# EAGLE design schematic_fitband2 (EAGLE 9.6.2)
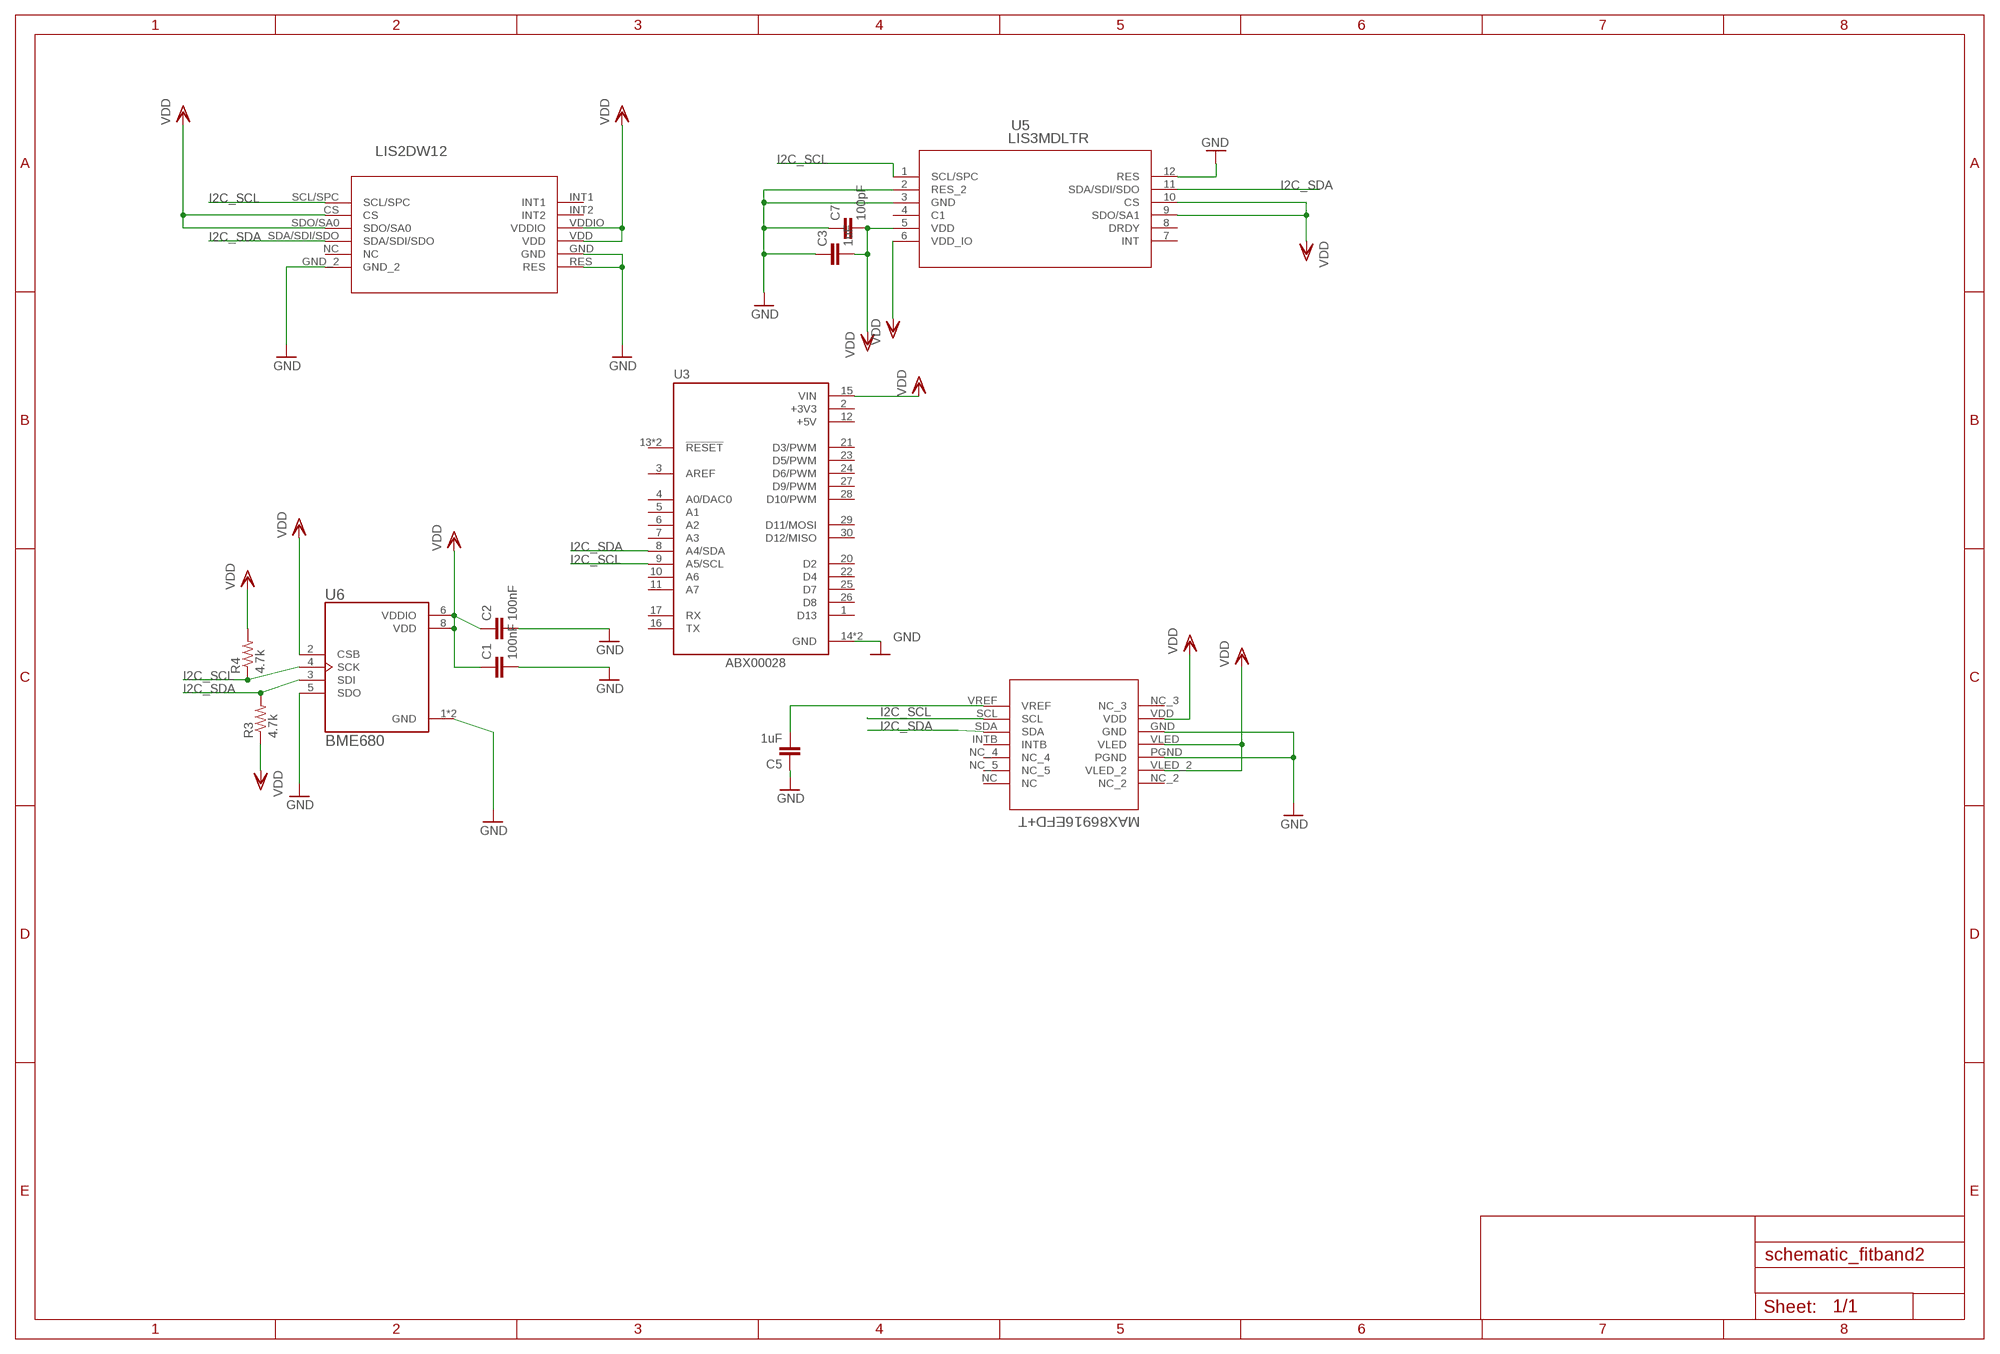
[diagram p0: schematic, sheet 1]

## Parts
C1  100nF  221E_PASSIVES_C0402  [221E_PASSIVES_C0402]
C2  100nF  221E_PASSIVES_C0402  [221E_PASSIVES_C0402]
C3  1uF  221E_PASSIVES_C0402  [221E_PASSIVES_C0402]
C5  1uF  221E_PASSIVES_C0402  [221E_PASSIVES_C0402]
C7  100pF  221E_PASSIVES_C0402  [221E_PASSIVES_C0402]
R3  4.7k  R-US_M0805  [M0805]
R4  4.7k  R-US_M0805  [M0805]
U1  MAX86916EFD+T  [21-100325_90-100122]
U2  LIS2DW12  [LIS2DW12_LGA-12_2X2X0P7_STM]
U3  ABX00028  [MODULE_ABX00028]
U5  LIS3MDLTR  [LGA-12_2X2X1_STM]
U6  BME680  [PSON80P300X300X100-8N]

## Nets
GND: C1.P$2 C2.P$2 C3.P$1 C5.P$1 C7.P$1 U1.GND U1.PGND U2.GND U2.GND_2 U2.RES U3.14(GND) U3.19(GND) U5.2(RES_2) U5.3(GND) U5.12(RES) U6.1(GND) U6.5(SDO) U6.7(GND)
I2C_SCL: R4.1 U1.SCL U2.SCL/SPC U3.9(A5/SCL) U5.1(SCL/SPC) U6.4(SCK)
I2C_SDA: R3.2 U1.SDA U2.SDA/SDI/SDO U3.8(A4/SDA) U5.11(SDA/SDI/SDO) U6.3(SDI)
N$1: C5.P$2 U1.VREF
VDD: C1.P$1 C2.P$1 C3.P$2 C7.P$2 R3.1 R4.2 U1.VDD U1.VLED U1.VLED_2 U2.CS U2.SDO/SA0 U2.VDD U2.VDDIO U3.15(VIN) U5.5(VDD) U5.6(VDD_IO) U5.9(SDO/SA1) U5.10(CS) U6.2(CSB) U6.6(VDDIO) U6.8(VDD)
Unconnected: U1.INTB U1.NC U1.NC_2 U1.NC_3 U1.NC_4 U1.NC_5 U2.INT1 U2.INT2 U2.NC U3.1(D13) U3.3(AREF) U3.4(A0/DAC0) U3.5(A1) U3.6(A2) U3.7(A3) U3.10(A6) U3.11(A7) U3.13(!RESET) U3.16(TX) U3.17(RX) U3.18(!RESET) U3.20(D2) U3.21(D3/PWM) U3.22(D4) U3.23(D5/PWM) U3.24(D6/PWM) U3.25(D7) U3.26(D8) U3.27(D9/PWM) U3.28(D10/PWM) U3.29(D11/MOSI) U3.30(D12/MISO) U5.4(C1) U5.7(INT) U5.8(DRDY)

## Power pins joined to a net without a drawn wire
+3V3: U3.2(+3V3)
+5V: U3.12(+5V)

## Library data of the parts
C1-C3 C5 C7 = PPG:221E_PASSIVES_C
R3 R4 = rcl:R-US_: RESISTOR, American symbol; SPICEPREFIX: R
U1 = max86916:MAX86916EFD+T: Max86916 eagle component, it's a ppg sensor with 4 different leds; BUILT_BY: EMA_Rebekah; COPYRIGHT: Copyright (C) 2018 Accelerated Designs. All rights reserved; MANUFACTURER_PART_NUMBER: MAX86916EFD+T; SOURCELIBRARY: Maxim_2020-05-05; VENDOR: Maxim Integrated Products
U2 = LIS2DW12:LIS2DW12
U3 = ABX00028:ABX00028: ATmega4809 Arduino Nano Every AVR AVR MCU 8-Bit Embedded Evaluation Board Check availability <https://pricing.snapeda.com/parts/Arduino%20Nano%20Every/Arduino/view-part?ref=eda>; AVAILABILITY: Not in stock; DESCRIPTION: Arduino’s 5V compatible board in the smallest available form factor: 45x18mm!; MF: Arduino; MP: Arduino Nano Every; PACKAGE: None; PRICE: None
U5 = LIS3MDLTR:LIS3MDLTR; COPYRIGHT: Copyright (C) 2023 Ultra Librarian. All rights reserved.; MANUFACTURER_PART_NUMBER: LIS3MDLTR; MFR_NAME: STMicroelectronics
U6 = BME680:BME680: Integrated Environmental Unit Check availability <https://pricing.snapeda.com/parts/BME680/Bosch%20Sensortec/view-part?ref=eda>; AVAILABILITY: In Stock; DESCRIPTION: Gas, Humidity, Pressure, Temperature Sensor I²C, SPI Output; MF: Bosch Sensortec; MP: BME680; PACKAGE: LGA-8 Bosch Tools; PRICE: None; PURCHASE-URL: https://pricing.snapeda.com/search/part/BME680/?ref=eda

## Net classes
1 VDD: width 0.254 mm

## Board
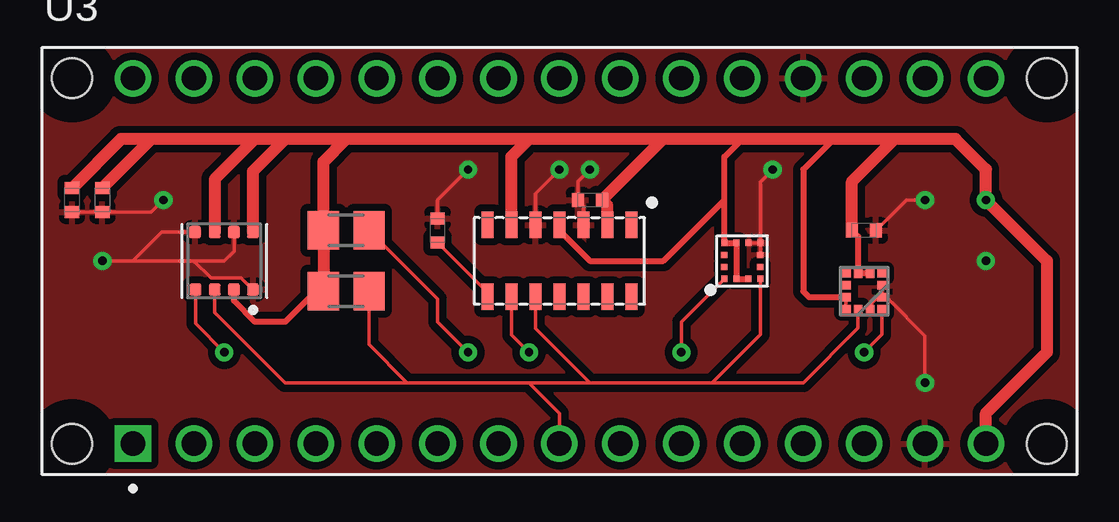
[diagram p1: board, top side]
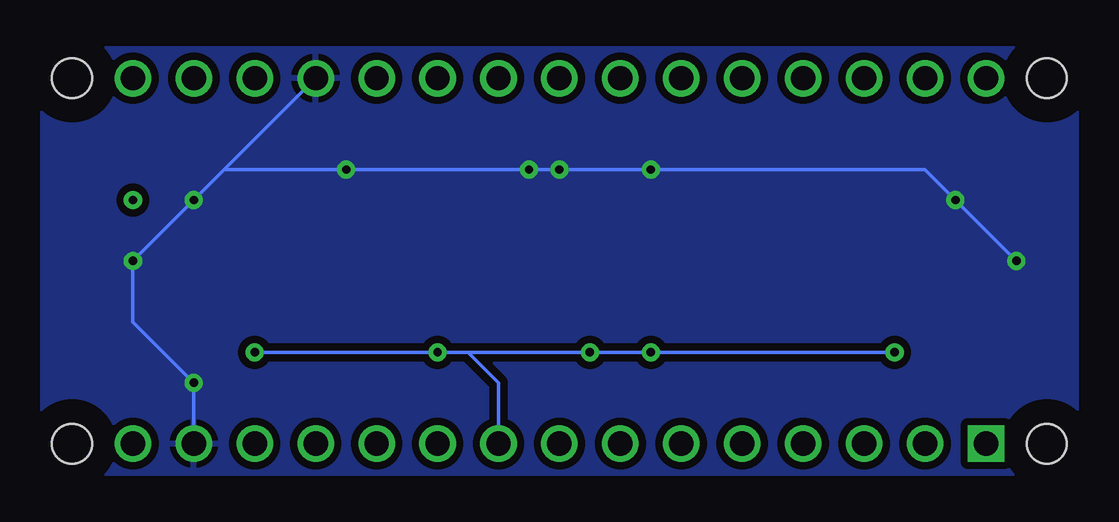
[diagram p2: board, bottom side, seen from below]

No outline drawn. Coordinates in mm, seen from the top.
Copper layers (1*16): Top 0.035mm / dielectric 1.5mm / Bottom 0.035mm
Design rules "default": minimum track width 6mil, minimum drill 0.35mm, track to track 6mil, track to pad 6mil, pad to pad 6mil, via to via 6mil, smd to smd 6mil, copper to edge 40mil, drill to drill 6mil, minimum pad ring 10mil, minimum via ring 8mil, stop-mask expansion 4mil, vias tented up to drill 0mil, thermal gap 10mil

### Footprints (pad centres in the part's own frame; a part is rotated, then mirrored left to right if it is on the bottom)
221E_PASSIVES_C0402 = smd 0.5 x 0.6: P$1 -0.5,0; P$2 0.5,0
M0805 = smd 1.3 x 1.6: 1 -0.95,0; 2 0.95,0
21-100325_90-100122 = smd 1.1 x 0.5: GND -1.5,-1; INTB 1.5,0; NC 1.5,3; NC_2 -1.5,3; NC_3 -1.5,-3; NC_4 1.5,1; NC_5 1.5,2; PGND -1.5,1; SCL 1.5,-2; SDA 1.5,-1; VDD -1.5,-2; VLED -1.5,0; VLED_2 -1.5,2; VREF 1.5,-3
LIS2DW12_LGA-12_2X2X0P7_STM = smd 0.275 x 0.25: CS -0.75,0.25; GND 0.75,-0.25; RES 0.75,-0.75; SCL/SPC -0.75,0.75; SDA/SDI/SDO -0.75,-0.75; SDO/SA0 -0.75,-0.25; VDD 0.75,0.25; VDDIO 0.75,0.75 | smd 0.25 x 0.275: GND_2 0.25,-0.75; INT1 -0.25,0.75; INT2 0.25,0.75; NC -0.25,-0.75
MODULE_ABX00028 = drill 1.016 square: 1 -17.78,-7.62 | drill 1.016: 2 -15.24,-7.62; 3 -12.7,-7.62; 4 -10.16,-7.62; 5 -7.62,-7.62; 6 -5.08,-7.62; 7 -2.54,-7.62; 8 0,-7.62; 9 2.54,-7.62; 10 5.08,-7.62; 11 7.62,-7.62; 12 10.16,-7.62; 13 12.7,-7.62; 14 15.24,-7.62; 15 17.78,-7.62; 16 17.78,7.62; 17 15.24,7.62; 18 12.7,7.62; 19 10.16,7.62; 20 7.62,7.62; 21 5.08,7.62; 22 2.54,7.62; 23 0,7.62; 24 -2.54,7.62; 25 -5.08,7.62; 26 -7.62,7.62; 27 -10.16,7.62; 28 -12.7,7.62; 29 -15.24,7.62; 30 -17.78,7.62 | hole 1.651: -20.32,-7.62; -20.32,7.62; 20.32,7.62; 20.32,-7.62
LGA-12_2X2X1_STM = smd 0.377 x 0.352: 1 -0.75,0.75; 2 -0.75,0.25; 3 -0.75,-0.25; 4 -0.75,-0.75; 7 0.75,-0.75; 8 0.75,-0.25; 9 0.75,0.25; 10 0.75,0.75 | smd 0.352 x 0.377: 5 -0.25,-0.75; 6 0.25,-0.75; 11 0.25,0.75; 12 -0.25,0.75
PSON80P300X300X100-8N = smd 0.5 x 0.5: 1 1.2,1.2; 2 1.2,0.4; 3 1.2,-0.4; 4 1.2,-1.2; 5 -1.2,-1.22; 6 -1.2,-0.4; 7 -1.2,0.4; 8 -1.2,1.2

### Placement (x,y rotation side)
C1  3.81,12.7 270 top
C2  2.54,12.7 270 top
C3  24.13,12.7 0 top
C5  17.78,11.43 270 top
C7  35.56,11.43 180 top
R3  13.97,8.89 0 top
R4  13.97,11.43 180 top
U1  22.86,10.16 270 top
U2  30.48,10.16 90 top
U3  22.86,10.16 0 top
U5  35.56,8.89 180 top
U6  8.89,10.16 270 top

### Tracks (layer width: path | path; a pad name or v marks a point on that pad's centre or on a via)
GND  (via drill 0.35)
  Top 0.152: U1.PGND 23.86,12.47 C3.P$1 23.63,13.47 v24.13,13.97 | U2.RES 31.23,13.45 v31.75,13.97 | U2.GND U2.RES | U2.RES U2.GND_2 | C7.P$1 37.33,12.7 v38.1,12.7 | U5.12 35.89,8.22 35.89,8.41 36.03,8.54 36.21,8.54 U5.2 | U5.3 U5.2 | U5.2 36.41,8.54 36.59,8.54 38.1,7.04 v38.1,5.08 | v6.35,12.7 5.85,12.2 C1.P$2 C2.P$2 | U6.5 6.28,11.36 5.08,10.16 v3.81,10.16 7.62,10.16 | C5.P$1 17.78,12.7 v19.05,13.97 | U1.GND 21.86,12.97 v22.86,13.97 | U6.7 9.29,10.56 8.89,10.16 7.62,10.16 | 10.16,9.03 U6.1 10.08,8.96 9.6,9.44 8.34,9.44 7.62,10.16
  Bottom 0.152: U3.14 v38.1,5.08 40.64,7.62 v40.64,10.16 v38.1,12.7 36.83,13.97 | 36.83,13.97 v31.75,13.97 v24.13,13.97 v22.86,13.97 v19.05,13.97 7.62,13.97 v6.35,12.7 v3.81,10.16 | U3.19 36.83,13.97
  pour Bottom (isolate 0.305): 1.27,19.05 1.27,1.27 44.45,1.27 44.45,19.05
  pour Top (isolate 0.305): 1.27,19.05 1.27,1.27 44.45,1.27 44.45,19.05
I2C_SCL  (via drill 0.35)
  Top 0.152: U2.SCL/SPC 27.94,7.62 v27.94,6.35 | U5.1 36.31,7.1 v35.56,6.35 | U6.4 7.69,7.55 v8.89,6.35 | R4.1 17.78,8.57 17.78,7.62 v19.05,6.35 | U1.SCL 20.86,7.08 v21.59,6.35
  Bottom 0.152: U3.9 25.4,5.08 26.67,6.35 | 26.67,6.35 v27.94,6.35 v35.56,6.35 | 26.67,6.35 v21.59,6.35 v19.05,6.35 v8.89,6.35
I2C_SDA
  Top 0.152: U3.8 22.86,3.81 21.59,5.08 | 16.51,5.08 21.59,5.08 | 16.51,5.08 14.92,6.67 R3.2 | 21.59,5.08 24.13,5.08 | 24.13,5.08 29.21,5.08 | U1.SDA 21.86,7.35 24.13,5.08 | 29.21,5.08 31.23,7.1 U2.SDA/SDI/SDO | 29.21,5.08 33.02,5.08 35.31,7.37 U5.11 | 16.51,5.08 11.43,5.08 8.49,8.02 U6.3
N$1
  Top 0.152: C5.P$2 19.86,8.85 U1.VREF
VDD  (via drill 0.35)
  Top 0.152: U5.9 U5.10
  Top 0.254: 29.73,12.7 U2.VDDIO U2.VDD U2.CS U2.SDO/SA0 | 29.73,12.7 29.73,14.49 30.48,15.24 | C7.P$2 35.31,11.18 U5.6 U5.5 | U5.9 33.27,8.64 33.02,8.89 33.02,13.97 34.29,15.24 | R3.1 12.7,8.89 11.43,7.62 10.16,7.62 9.29,8.49 U6.2 | U1.VLED 22.86,11.43 24.13,10.16 27.19,10.16 29.73,12.7
  Top 0.5: U1.VLED_2 24.86,12.47 C3.P$2 27.17,15.24 | U3.15 40.64,3.81 43.18,6.35 43.18,10.16 v40.64,12.7 40.64,13.97 39.37,15.24 36.83,15.24 | C1.P$1 5.85,15.24 | 36.83,15.24 34.29,15.24 30.48,15.24 27.17,15.24 | 27.17,15.24 21.59,15.24 | 21.59,15.24 13.97,15.24 | 13.97,15.24 11.43,15.24 | 11.43,15.24 10.16,15.24 | 10.16,15.24 5.85,15.24 | 5.85,15.24 4.58,15.24 C2.P$1 | 10.16,15.24 8.49,13.57 U6.6 | U6.8 10.09,13.9 11.43,15.24 | 13.97,15.24 13.02,14.29 R4.2 R3.1 | U1.VDD 20.86,14.51 21.59,15.24 | C7.P$2 35.06,13.47 36.83,15.24